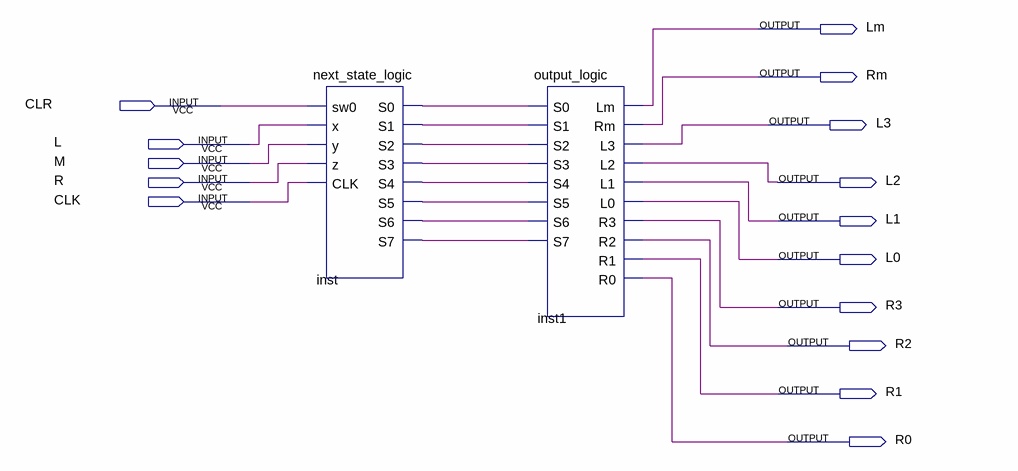
[diagram p0: schematic sheet]
// Quartus schematic statemachine_block.bdf as structural Verilog: 2 symbols, 15 pins
module statemachine_block (
  input  CLR,
  input  L,
  input  M,
  input  R,
  input  CLK,
  output Lm,
  output Rm,
  output L3,
  output L2,
  output L1,
  output L0,
  output R3,
  output R2,
  output R1,
  output R0
);

  wire inst_s0, inst_s1, inst_s2, inst_s3, inst_s4, inst_s5, inst_s6, inst_s7;

  next_state_logic inst (
    .sw0(CLR), .x(L), .y(M), .z(R), .CLK(CLK), .S0(inst_s0), .S1(inst_s1), .S2(inst_s2), .S3(inst_s3),
    .S4(inst_s4), .S5(inst_s5), .S6(inst_s6), .S7(inst_s7));
  output_logic inst1 (
    .S0(inst_s0), .S1(inst_s1), .S2(inst_s2), .S3(inst_s3), .S4(inst_s4), .S5(inst_s5), .S6(inst_s6),
    .S7(inst_s7), .Lm(Lm), .Rm(Rm), .L3(L3), .L2(L2), .L1(L1), .L0(L0), .R3(R3), .R2(R2), .R1(R1), .R0(R0));
endmodule
